# EAGLE design breakout-40p-v1 (EAGLE 7.7.0)
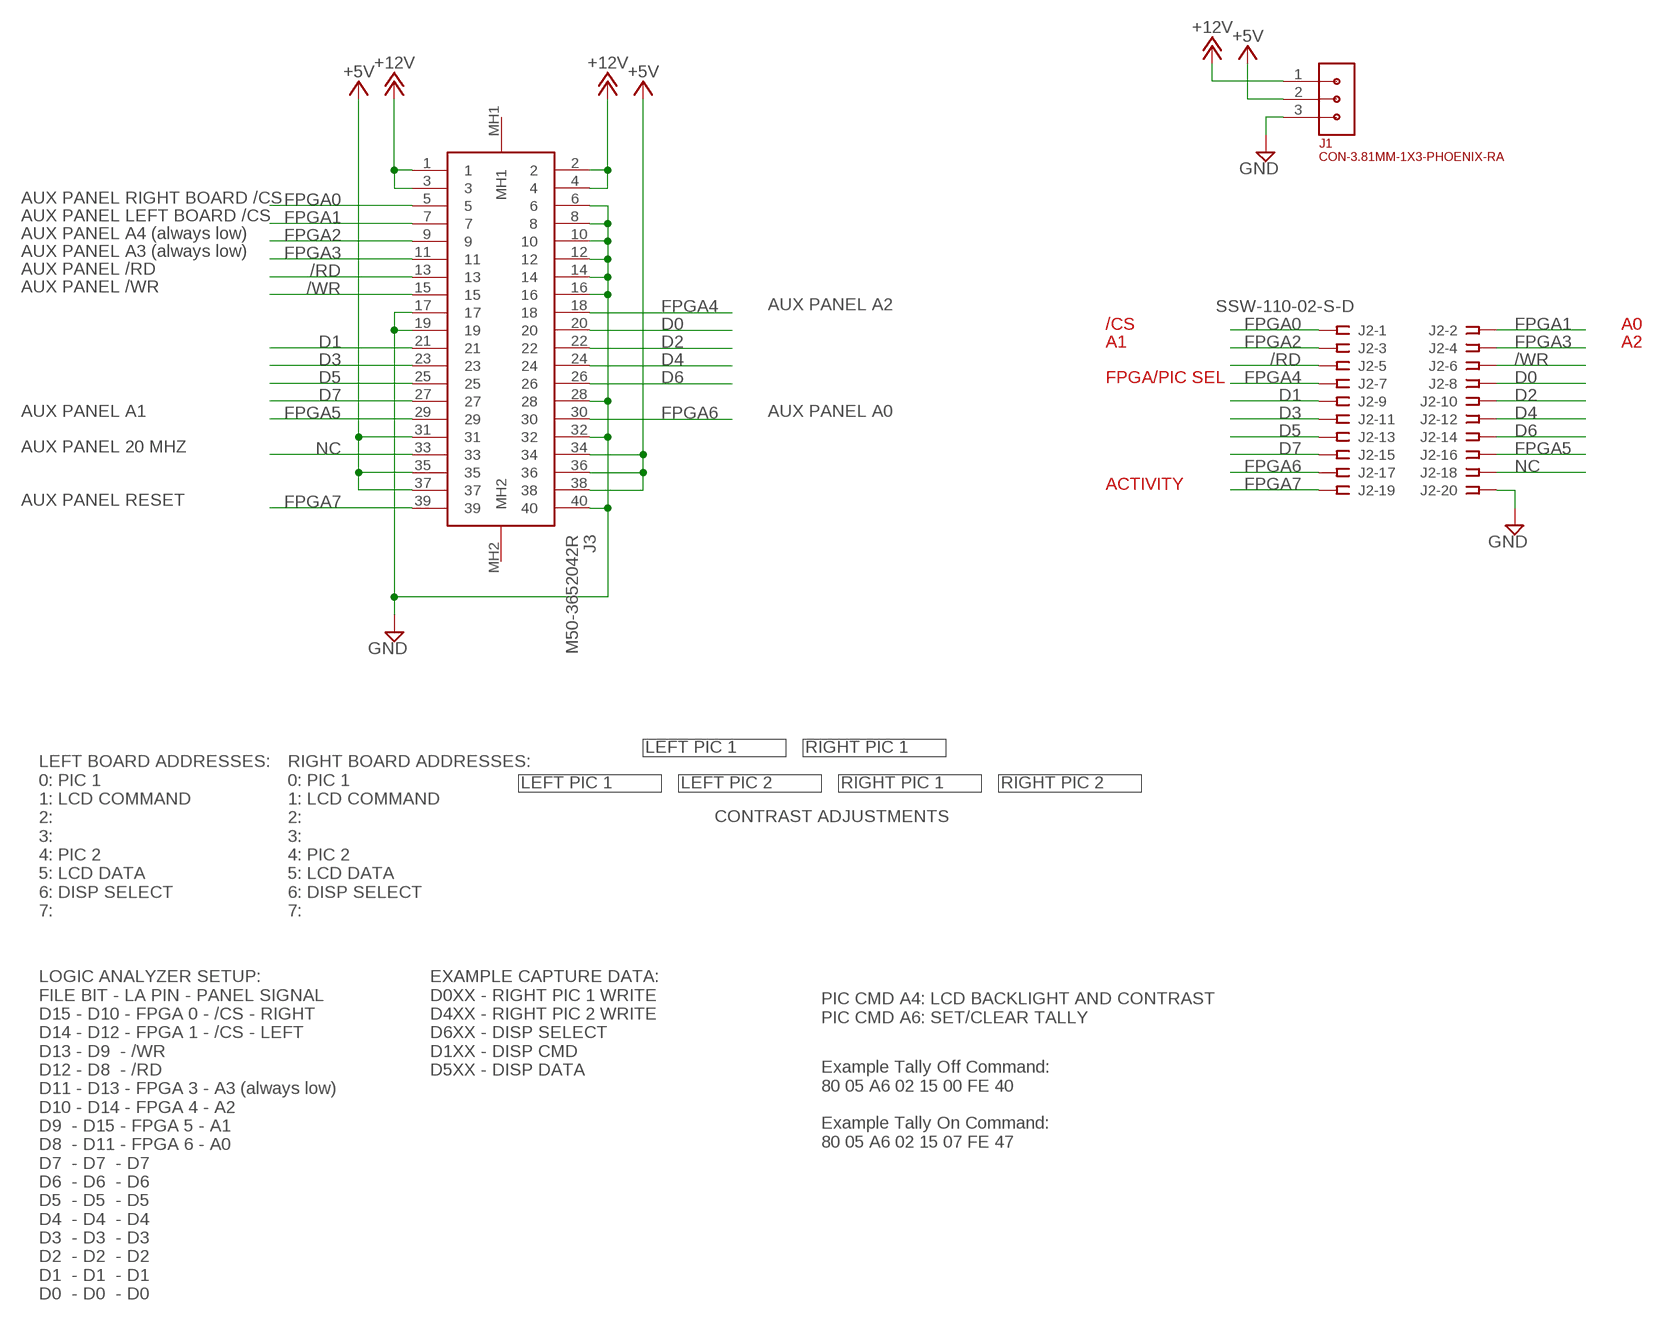
[diagram p0: schematic, sheet 1]

## Parts
J1  CON-3.81MM-1X3-PHOENIX-RA  [CON-PHOENIX-3.81-1X3-RA]
J2  SSW-110-02-S-D  [SSW-110-02-S-D]
J3  M50-3652042R  [M503652042R]

## Nets
+5V: J1.2 J3.31 J3.34 J3.35 J3.36 J3.37 J3.38
+12V: J1.1 J3.1 J3.2 J3.3 J3.4
/RD: J2.5 J3.13
/WR: J2.6 J3.15
D0: J2.8 J3.20
D1: J2.9 J3.21
D2: J2.10 J3.22
D3: J2.11 J3.23
D4: J2.12 J3.24
D5: J2.13 J3.25
D6: J2.14 J3.26
D7: J2.15 J3.27
FPGA0: J2.1 J3.5
FPGA1: J2.2 J3.7
FPGA2: J2.3 J3.9
FPGA3: J2.4 J3.11
FPGA4: J2.7 J3.18
FPGA5: J2.16 J3.29
FPGA6: J2.17 J3.30
FPGA7: J2.19 J3.39
GND: J1.3 J2.20 J3.6 J3.8 J3.10 J3.12 J3.14 J3.16 J3.17 J3.19 J3.28 J3.32 J3.40
NC: J2.18 J3.33
Unconnected: J3.MH1 J3.MH2

## Notes on the sheet
- AUX PANEL RIGHT BOARD /CS
- AUX PANEL LEFT BOARD /CS
- AUX PANEL A4 (always low)
- AUX PANEL A3 (always low)
- AUX PANEL /RD
- AUX PANEL /WR
- AUX PANEL A2
- /CS | A0
- A1 | A2
- FPGA/PIC SEL
- AUX PANEL A1 | AUX PANEL A0
- AUX PANEL 20 MHZ
- ACTIVITY
- AUX PANEL RESET
- LEFT PIC 1 | RIGHT PIC 1
- LEFT BOARD ADDRESSES:
  0: PIC 1
  1: LCD COMMAND
  2: 
  3: 
  4: PIC 2
  5: LCD DATA
  6: DISP SELECT
  7:
- RIGHT BOARD ADDRESSES:
  0: PIC 1
  1: LCD COMMAND
  2: 
  3: 
  4: PIC 2
  5: LCD DATA
  6: DISP SELECT
  7:
- LEFT PIC 1 | LEFT PIC 2 | RIGHT PIC 1 | RIGHT PIC 2
- CONTRAST ADJUSTMENTS
- LOGIC ANALYZER SETUP:
  FILE BIT - LA PIN - PANEL SIGNAL
  D15 - D10 - FPGA 0 - /CS - RIGHT
  D14 - D12 - FPGA 1 - /CS - LEFT
  D13 - D9  - /WR
  D12 - D8  - /RD
  D11 - D13 - FPGA 3 - A3 (always low)
  D10 - D14 - FPGA 4 - A2
  D9  - D15 - FPGA 5 - A1
  D8  - D11 - FPGA 6 - A0
  D7  - D7  - D7
  D6  - D6  - D6
  D5  - D5  - D5
  D4  - D4  - D4
  D3  - D3  - D3
  D2  - D2  - D2
  D1  - D1  - D1
  D0  - D0  - D0
- EXAMPLE CAPTURE DATA:
  D0XX - RIGHT PIC 1 WRITE
  D4XX - RIGHT PIC 2 WRITE
  D6XX - DISP SELECT
  D1XX - DISP CMD
  D5XX - DISP DATA
- PIC CMD A4: LCD BACKLIGHT AND CONTRAST
  PIC CMD A6: SET/CLEAR TALLY
- Example Tally Off Command:
  80 05 A6 02 15 00 FE 40
  
  Example Tally On Command:
  80 05 A6 02 15 07 FE 47

## Library data of the parts
J1 = 0GlenConnectors:CON-3.81MM-1X3-PHOENIX-RA
J2 = con-samtec:SSW-110-02-S-D: THROUGH-HOLE .025" SQ POST SOCKET Source: Samtec SSW.pdf; MPN: SSW-110-02-S-D; OC_FARNELL: unknown; OC_NEWARK: 11P9480
J3 = M50-3652042R:M50-3652042R: HARWIN Archer M50, 1.27mm Pitch, 40 Way, 2 Row, Vertical PCB Header, Surface Mount Source: Datasheet <https://componentsearchengine.com/Datasheets/1/M50-3652042R.pdf>; ARROW_PART_NUMBER: M50-3652042R; DESCRIPTION: HARWIN Archer M50, 1.27mm Pitch, 40 Way, 2 Row, Vertical PCB Header, Surface Mount; HEIGHT: 11.6mm; MANUFACTURER_NAME: Harwin; MANUFACTURER_PART_NUMBER: M50-3652042R; MOUSER_PART_NUMBER: 855-M50-3652042R; MOUSER_PRICE-STOCK: https://www.mouser.co.uk/ProductDetail/Harwin/M50-3652042R?qs=gf2s0yP%252B7bfJki3ikJTXrQ%3D%3D

## Board
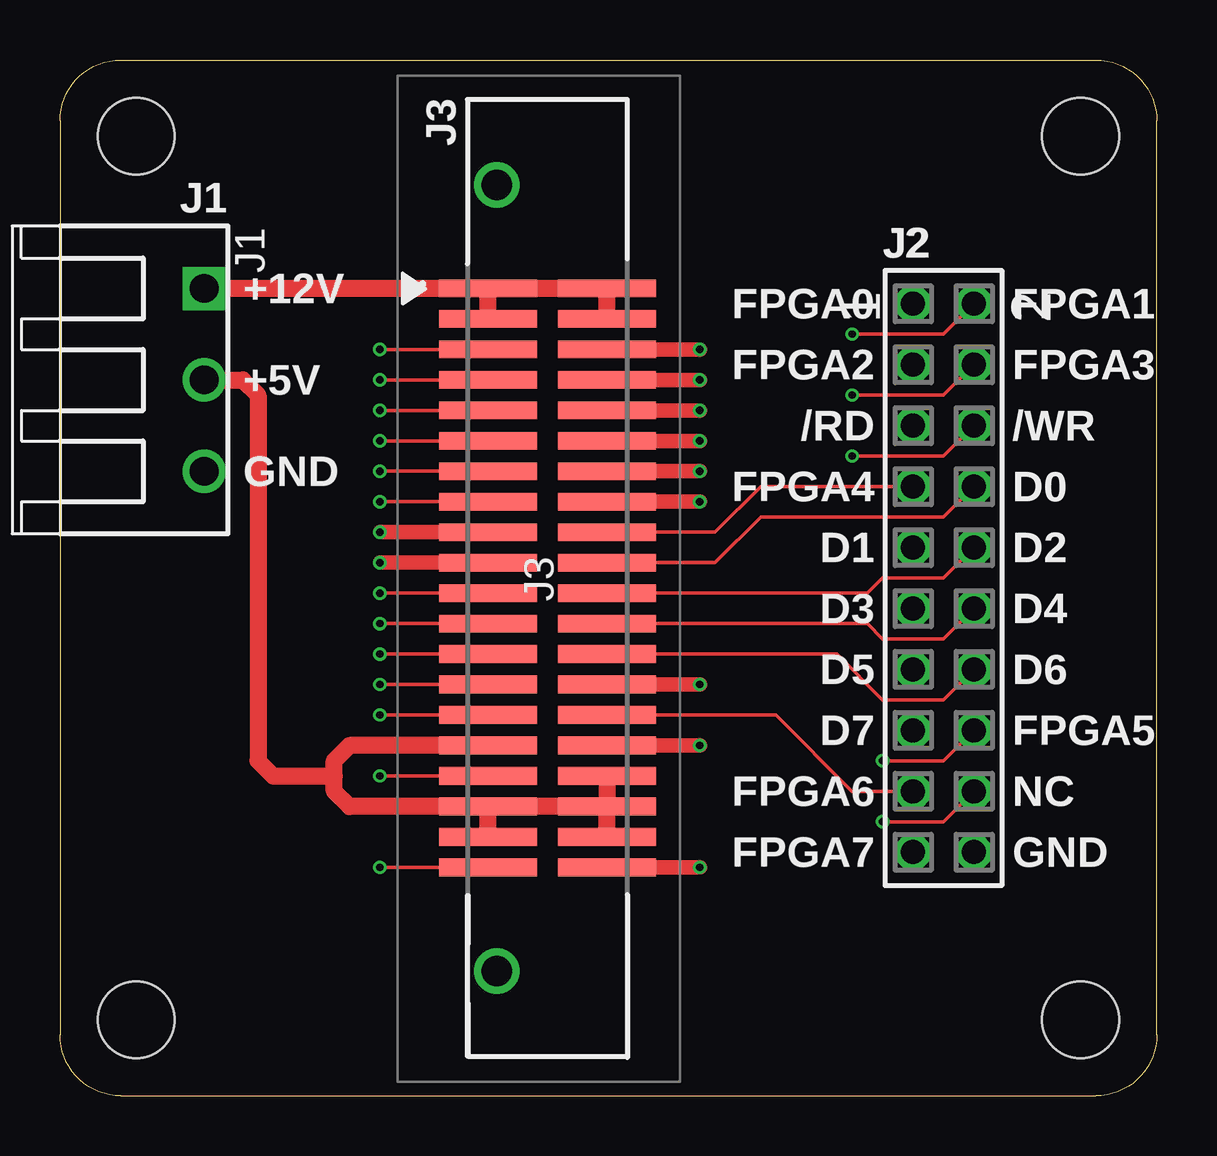
[diagram p1: board, top side]
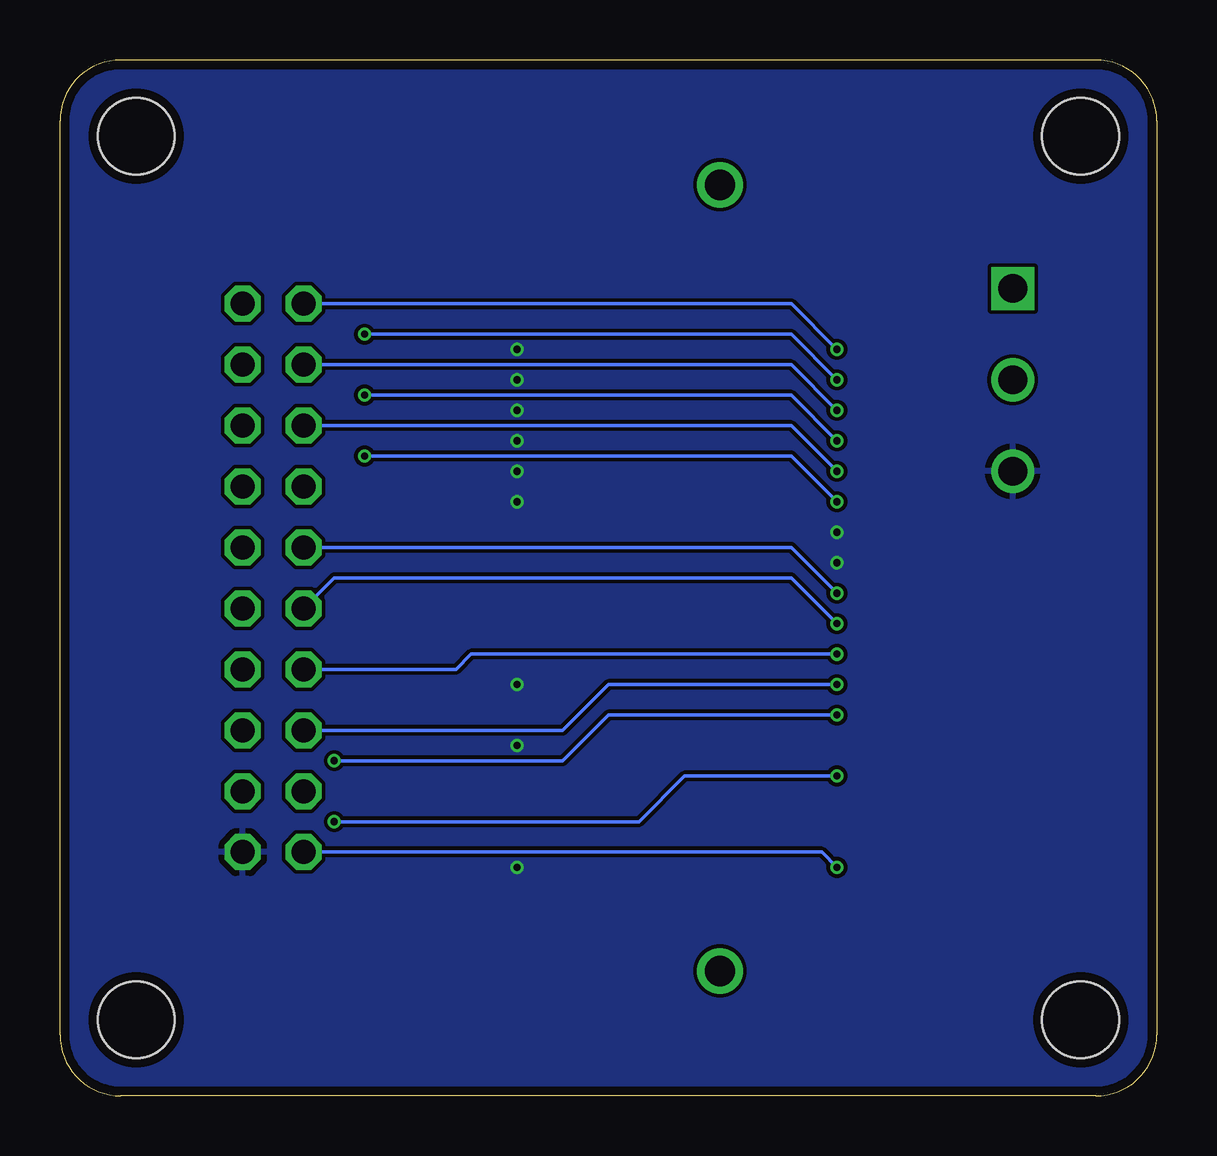
[diagram p2: board, bottom side, seen from below]

Size 45.72 x 43.18 mm. Coordinates in mm from the lower left corner, seen from the top.
Outline: 0,40.64 arc-90 2.54,43.18 43.18,43.18 arc-90 45.72,40.64 45.72,2.54 arc-90 43.18,0 2.54,0 arc-90 0,2.54 0,40.64
Copper layers (1*16): Top 0.035559375mm / dielectric 1.6mm / Bottom 0.035559375mm
Design rules "oshpark-2layer-2018": minimum track width 6mil, minimum drill 10mil, track to track 6mil, track to pad 6mil, pad to pad 6mil, via to via 6mil, smd to smd 6mil, copper to edge 15mil, drill to drill 6mil, minimum pad ring 5mil, minimum via ring 5mil, stop-mask expansion 2.5mil, vias tented up to drill 0mil, thermal gap 10mil
Holes 3.2 mm at 3.17,40.01 3.17,3.17 42.55,3.17 42.55,40.01

### Footprints (pad centres in the part's own frame; a part is rotated, then mirrored left to right if it is on the bottom)
CON-PHOENIX-3.81-1X3-RA = drill 1.2 square: 1 0,0 | drill 1.2: 2 3.81,0; 3 7.62,0
SSW-110-02-S-D = drill 1 pad 1.5 octagon: 1 -11.43,-1.27; 2 -11.43,1.27; 3 -8.89,-1.27; 4 -8.89,1.27; 5 -6.35,-1.27; 6 -6.35,1.27; 7 -3.81,-1.27; 8 -3.81,1.27; 9 -1.27,-1.27; 10 -1.27,1.27; 11 1.27,-1.27; 12 1.27,1.27; 13 3.81,-1.27; 14 3.81,1.27; 15 6.35,-1.27; 16 6.35,1.27; 17 8.89,-1.27; 18 8.89,1.27; 19 11.43,-1.27; 20 11.43,1.27
M503652042R = smd 0.74 x 4.09: 1 -12.065,-2.475; 2 -12.065,2.475; 3 -10.795,-2.475; 4 -10.795,2.475; 5 -9.525,-2.475; 6 -9.525,2.475; 7 -8.255,-2.475; 8 -8.255,2.475; 9 -6.985,-2.475; 10 -6.985,2.475; 11 -5.715,-2.475; 12 -5.715,2.475; 13 -4.445,-2.475; 14 -4.445,2.475; 15 -3.175,-2.475; 16 -3.175,2.475; 17 -1.905,-2.475; 18 -1.905,2.475; 19 -0.635,-2.475; 20 -0.635,2.475; 21 0.635,-2.475; 22 0.635,2.475; 23 1.905,-2.475; 24 1.905,2.475; 25 3.175,-2.475; 26 3.175,2.475; 27 4.445,-2.475; 28 4.445,2.475; 29 5.715,-2.475; 30 5.715,2.475; 31 6.985,-2.475; 32 6.985,2.475; 33 8.255,-2.475; 34 8.255,2.475; 35 9.525,-2.475; 36 9.525,2.475; 37 10.795,-2.475; 38 10.795,2.475; 39 12.065,-2.475; 40 12.065,2.475 | drill 1.27 pad 1.905: MH1 -16.385,-2.11; MH2 16.385,-2.11

### Placement (x,y rotation side)
J1  6.01,33.66 270 top
J2  36.83,21.59 270 top
J3  20.32,21.59 270 top

### Tracks (layer width: path | path; a pad name or v marks a point on that pad's centre or on a via)
+5V
  Top 0.711: J3.37 J3.35 | J3.38 J3.36 | J3.34 J3.36 | J3.36 J3.35 | J3.31 12.06,14.61 11.43,13.97 11.43,13.34 | J3.35 12.06,12.06 11.43,12.7 11.43,13.34 | J1.2 7.62,29.84 8.26,29.21 8.26,13.97 8.89,13.34 11.43,13.34
+12V
  Top 0.711: J3.4 J3.2 J3.1 | J3.3 J3.1 | J3.1 J1.1
/RD  (via drill 0.3)
  Top 0.152: J3.13 v13.34,26.04
  Bottom 0.152: v13.34,26.04 15.24,27.94 J2.5
/WR  (via drill 0.3)
  Top 0.152: J3.15 v13.34,24.77 | v33.02,26.67 36.83,26.67 J2.6
  Bottom 0.152: v13.34,24.77 15.24,26.67 v33.02,26.67
D0
  Top 0.152: J3.20 27.3,22.23 29.21,24.13 36.83,24.13 J2.8
D1  (via drill 0.3)
  Top 0.152: J3.21 v13.34,20.95
  Bottom 0.152: v13.34,20.95 15.24,22.86 J2.9
D2
  Top 0.152: J3.22 33.66,20.95 34.29,21.59 36.83,21.59 J2.10
D3  (via drill 0.3)
  Top 0.152: J3.23 v13.34,19.68
  Bottom 0.152: v13.34,19.68 15.24,21.59 34.29,21.59 J2.11
D4
  Top 0.152: J3.24 33.66,19.68 34.29,19.05 36.83,19.05 J2.12
D5  (via drill 0.3)
  Top 0.152: J3.25 v13.34,18.41
  Bottom 0.152: v13.34,18.41 28.57,18.41 29.21,17.78 J2.13
D6
  Top 0.152: J3.26 32.38,18.41 34.29,16.51 36.83,16.51 J2.14
D7  (via drill 0.3)
  Top 0.152: J3.27 v13.34,17.14
  Bottom 0.152: v13.34,17.14 22.86,17.14 24.77,15.24 J2.15
FPGA0  (via drill 0.3)
  Top 0.152: v13.34,31.11 J3.5
  Bottom 0.152: J2.1 15.24,33.02 v13.34,31.11
FPGA1  (via drill 0.3)
  Top 0.152: J2.2 36.83,31.75 v33.02,31.75 | v13.34,29.84 J3.7
  Bottom 0.152: v33.02,31.75 15.24,31.75 v13.34,29.84
FPGA2  (via drill 0.3)
  Top 0.152: J3.9 v13.34,28.57
  Bottom 0.152: v13.34,28.57 15.24,30.48 J2.3
FPGA3  (via drill 0.3)
  Top 0.152: J3.11 v13.34,27.3 | v33.02,29.21 36.83,29.21 J2.4
  Bottom 0.152: v13.34,27.3 15.24,29.21 v33.02,29.21
FPGA4
  Top 0.152: J3.18 27.3,23.5 29.21,25.4 J2.7
FPGA5  (via drill 0.3)
  Top 0.152: J3.29 v13.34,15.88 | v34.29,13.97 36.83,13.97 J2.16
  Bottom 0.152: v13.34,15.88 22.86,15.88 24.77,13.97 v34.29,13.97
FPGA6
  Top 0.152: J2.17 33.02,12.7 29.84,15.88 J3.30
FPGA7  (via drill 0.3)
  Top 0.152: J3.39 v13.34,9.53
  Bottom 0.152: v13.34,9.53 13.97,10.16 J2.19
GND  (via drill 0.3)
  Top 0.61: J3.6 v26.67,31.11 | J3.8 v26.67,29.84 | J3.10 v26.67,28.57 | J3.12 v26.67,27.3 | J3.14 v26.67,26.04 | J3.16 v26.67,24.77 | J3.17 v13.34,23.5 | J3.19 v13.34,22.23 | J3.28 v26.67,17.14 | J3.32 v26.67,14.61 | J3.40 v26.67,9.53
  pour Bottom: 0,43.18 0,0 45.72,0 45.72,43.18
NC  (via drill 0.3)
  Top 0.152: J3.33 v13.34,13.34 | v34.29,11.43 36.83,11.43 J2.18
  Bottom 0.152: v13.34,13.34 19.68,13.34 21.59,11.43 v34.29,11.43

### Text on the board
_tsilk: J3 | J1 | J2 | +12V | FPGA0 | FPGA1 | +5V | FPGA2 | FPGA3 | /RD | /WR | GND | FPGA4 | D0 | D1 | D2 | D3 | D4 | D5 | D6 | D7 | FPGA5 | FPGA6 | NC | FPGA7 | GND